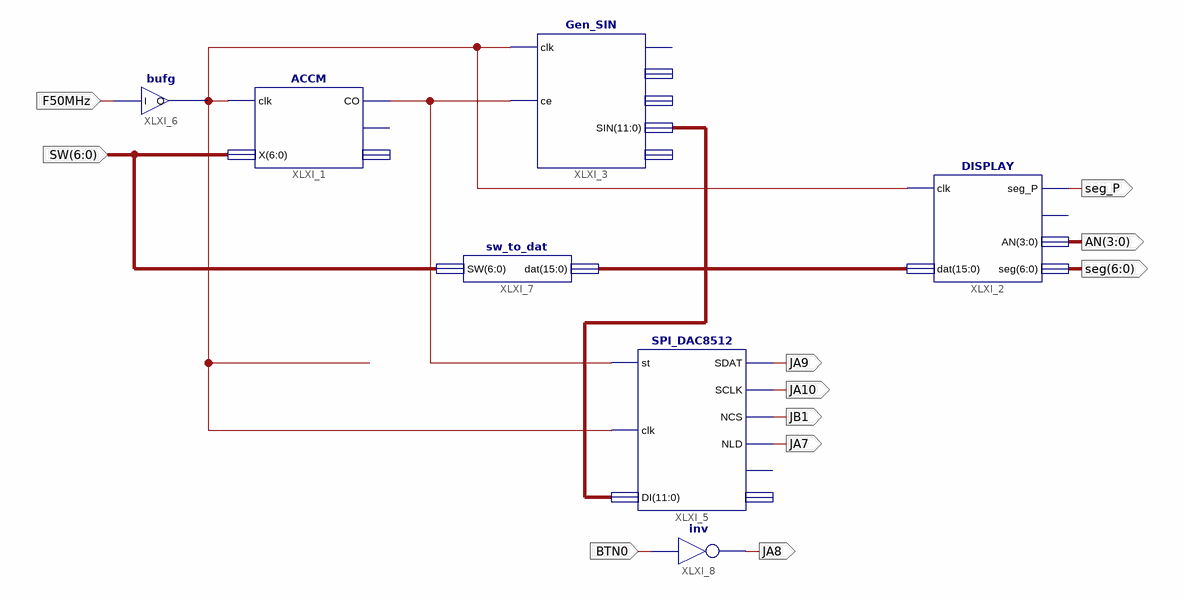
[diagram p0: schematic sheet 1]
// Xilinx ISE schematic Sch.sch (spartan3e) as structural Verilog: 7 symbols, 11 ports
module Sch (
  input  F50MHz,
  input  [6:0] SW,
  input  BTN0,
  output JA9,
  output JA10,
  output JB1,
  output JA7,
  output [3:0] AN,
  output [6:0] seg,
  output seg_P,
  output JA8
);

  wire XLXN_1, XLXN_16;
  wire [11:0] XLXN_6;
  wire [15:0] XLXN_22;

  ACCM XLXI_1 (.clk(XLXN_16), .X(SW), .CO(XLXN_1));  // open: Mx, ACC
  DISPLAY XLXI_2 (.clk(XLXN_16), .dat(XLXN_22), .seg_P(seg_P), .AN(AN), .seg(seg));  // open: ce1ms
  SPI_DAC8512 XLXI_5 (
    .st(XLXN_1), .clk(XLXN_16), .DI(XLXN_6), .SDAT(JA9), .SCLK(JA10), .NCS(JB1), .NLD(JA7));  // open: ce, cb_bit
  bufg XLXI_6 (.I(F50MHz), .O(XLXN_16));
  sw_to_dat XLXI_7 (.SW(SW), .dat(XLXN_22));
  not XLXI_8 (JA8, BTN0);
  Gen_SIN XLXI_3 (.clk(XLXN_16), .ce(XLXN_1), .SIN(XLXN_6));  // open: S, X, Y, SIN_L
endmodule
